# EAGLE design QRsch_v2.0 (EAGLE 7.2.0)
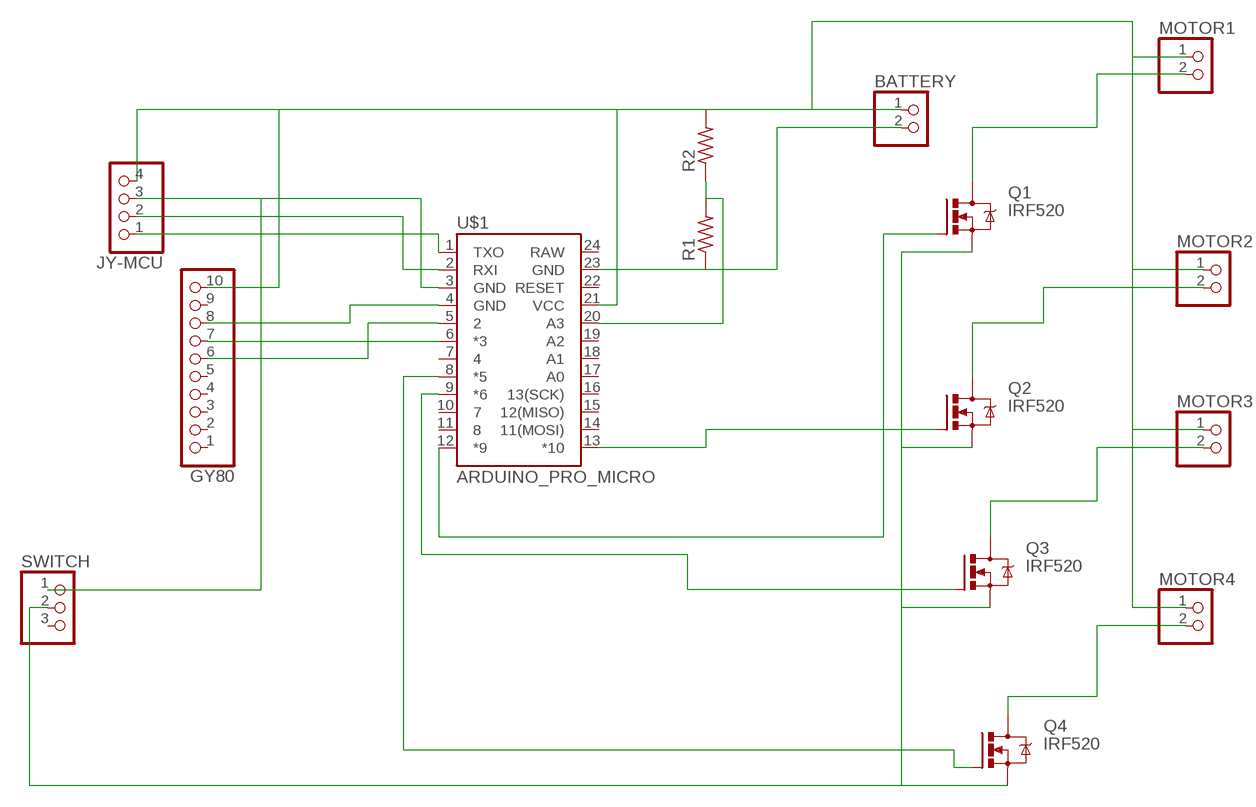
[diagram p0: schematic, sheet 1]

## Parts
BATTERY  PINHD-1X2/90  [1X02/90]
GY80  PINHD-1X10  [1X10]
JY-MCU  PINHD-1X4  [1X04]
MOTOR1  PINHD-1X2/90  [1X02/90]
MOTOR2  PINHD-1X2/90  [1X02/90]
MOTOR3  PINHD-1X2/90  [1X02/90]
MOTOR4  PINHD-1X2/90  [1X02/90]
Q1  IRF520  [TO220BV]
Q2  IRF520  [TO220BV]
Q3  IRF520  [TO220BV]
Q4  IRF520  [TO220BV]
R1  R-US_0207/7  [0207/7]
R2  R-US_0207/7  [0207/7]
SWITCH  PINHD-1X3  [1X03]
U$1  ARDUINO_PRO_MICRO  [ARDUINO_PRO_MICRO]

## Nets
GND: BATTERY.2 GY80.8 JY-MCU.3 R1.1 SWITCH.1 U$1.3(GND) U$1.4(GND) U$1.23(GND)
N$1: R1.2 R2.1 U$1.20(A3)
N$2: Q4.G U$1.8(*5)
N$3: Q3.G U$1.9(*6)
N$4: Q1.G U$1.12(*9)
N$5: MOTOR1.2 Q1.D
N$6: JY-MCU.2 U$1.2(RXI)
N$7: JY-MCU.1 U$1.1(TXO)
N$8: GY80.7 U$1.6(*3)
N$9: GY80.6 U$1.5
N$11: MOTOR2.2 Q2.D
N$12: MOTOR3.2 Q3.D
N$13: MOTOR4.2 Q4.D
N$15: Q1.S Q2.S Q3.S Q4.S SWITCH.2
N$27: Q2.G U$1.13(*10)
RAW: BATTERY.1 GY80.10 JY-MCU.4 MOTOR1.1 MOTOR2.1 MOTOR3.1 MOTOR4.1 R2.2 U$1.21(VCC)
Unconnected: GY80.1 GY80.2 GY80.3 GY80.4 GY80.5 GY80.9 SWITCH.3 U$1.7 U$1.10 U$1.11 U$1.14(11(MOSI)) U$1.15(12(MISO)) U$1.16(13(SCK)) U$1.17(A0) U$1.18(A1) U$1.19(A2) U$1.22(RESET) U$1.24(RAW)

## Library data of the parts
BATTERY MOTOR1-MOTOR4 = pinhead:PINHD-1X2: PIN HEADER
GY80 = pinhead:PINHD-1X10: PIN HEADER
JY-MCU = pinhead:PINHD-1X4: PIN HEADER
Q1-Q4 = transistor-power:IRF520: HEXFET Power MOSFET
R1 R2 = resistor:R-US_: RESISTOR, American symbol
SWITCH = pinhead:PINHD-1X3: PIN HEADER
U$1 = SparkFun-Boards:ARDUINO_PRO_MICRO

## Board
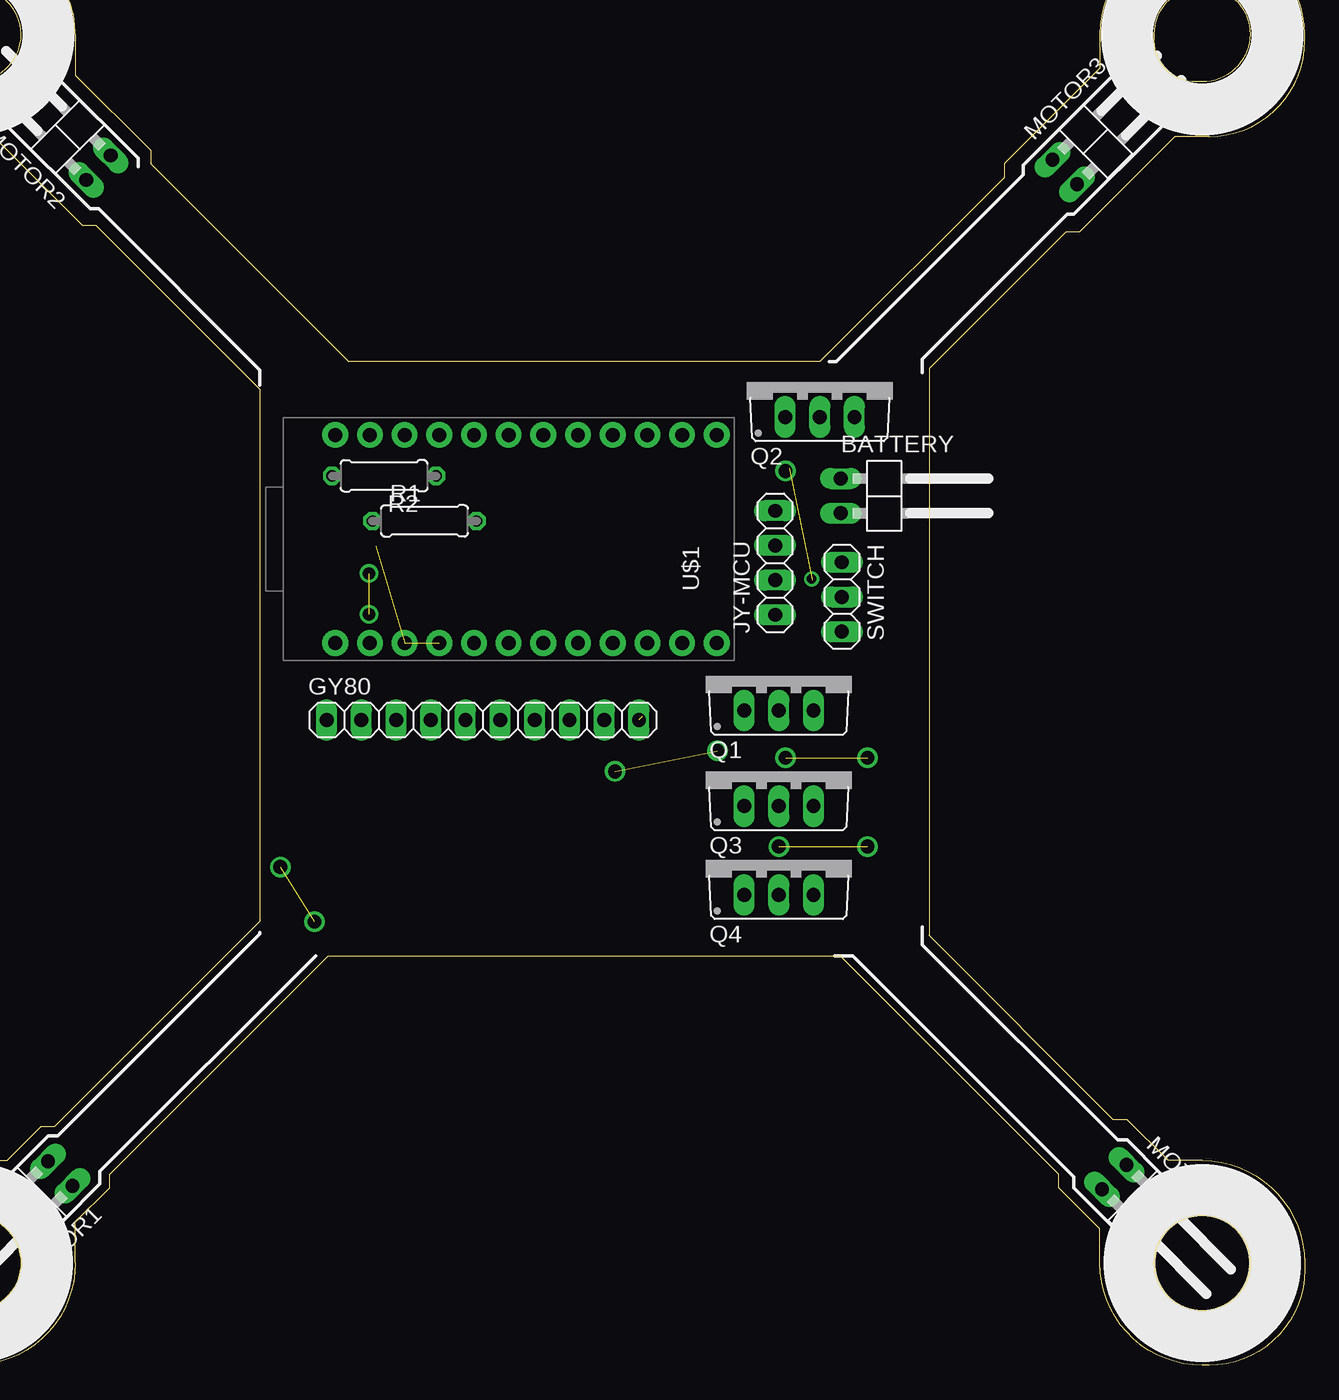
[diagram p1: board, top side]
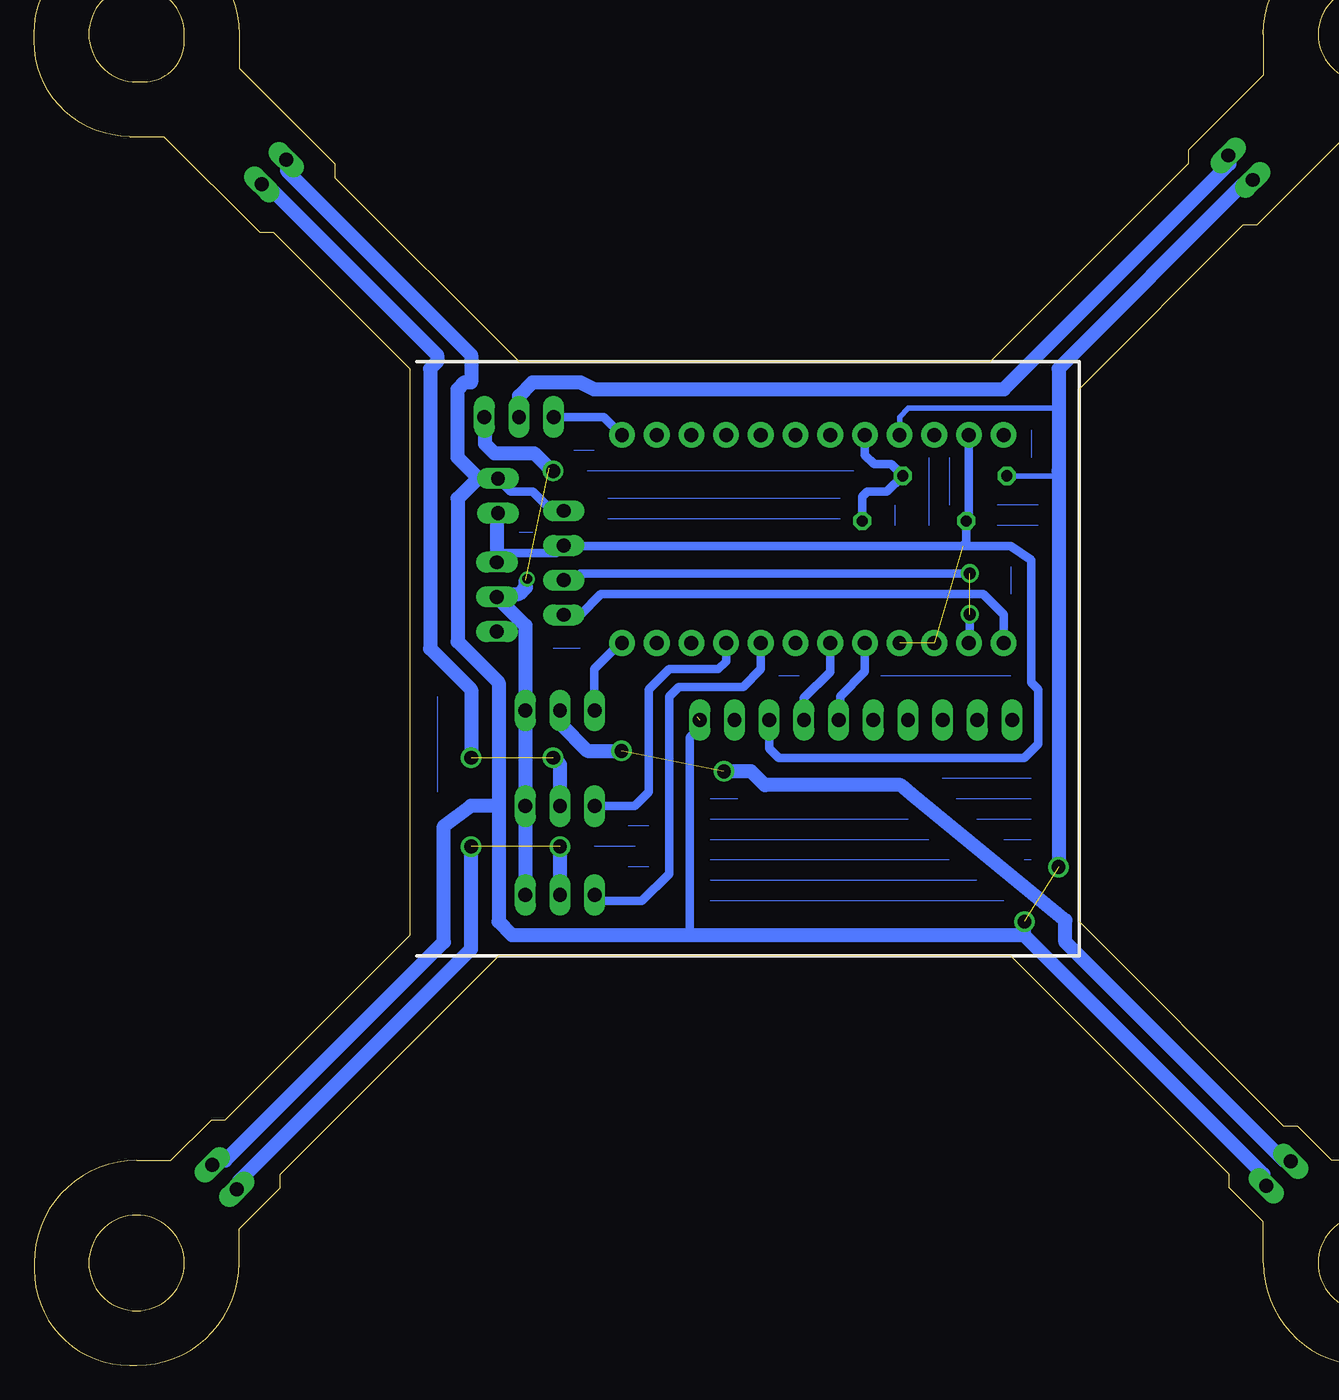
[diagram p2: board, bottom side, seen from below]

Size 7.5 x 97.5 mm. Coordinates in mm from the lower left corner, seen from the top.
Outline: 0.5,0 0,0
Outline: 7.5,97 7.5,97.5
Copper layers (1*16): Top 0.035mm / dielectric 1.5mm / Bottom 0.035mm
Design rules "default": minimum track width 10mil, minimum drill 24mil, track to track 8mil, track to pad 8mil, pad to pad 8mil, via to via 8mil, smd to smd 8mil, copper to edge 40mil, drill to drill 8mil, minimum pad ring 10mil, minimum via ring 8mil, stop-mask expansion 4mil, vias tented up to drill 0mil, thermal gap 10mil
Milling: 67 lines

### Footprints (pad centres in the part's own frame; a part is rotated, then mirrored left to right if it is on the bottom)
1X02/90 = drill 1.016 long: 1 -1.27,-3.81; 2 1.27,-3.81
1X10 = drill 1.016 long: 1 -11.43,0; 2 -8.89,0; 3 -6.35,0; 4 -3.81,0; 5 -1.27,0; 6 1.27,0; 7 3.81,0; 8 6.35,0; 9 8.89,0; 10 11.43,0
1X04 = drill 1.016 long: 1 -3.81,0; 2 -1.27,0; 3 1.27,0; 4 3.81,0
TO220BV = drill 1.016 long: D 0,-2.54; G -2.54,-2.54; S 2.54,-2.54
0207/7 = drill 0.813 octagon: 1 -3.81,0; 2 3.81,0
1X03 = drill 1.016 long: 1 -2.54,0; 2 0,0; 3 2.54,0
ARDUINO_PRO_MICRO = drill 1.016 pad 1.88: 1 -7.62,12.7; 2 -7.62,10.16; 3 -7.62,7.62; 4 -7.62,5.08; 5 -7.62,2.54; 6 -7.62,0; 7 -7.62,-2.54; 8 -7.62,-5.08; 9 -7.62,-7.62; 10 -7.62,-10.16; 11 -7.62,-12.7; 12 -7.62,-15.24; 13 7.62,-15.24; 14 7.62,-12.7; 15 7.62,-10.16; 16 7.62,-7.62; 17 7.62,-5.08; 18 7.62,-2.54; 19 7.62,0; 20 7.62,2.54; 21 7.62,5.08; 22 7.62,7.62; 23 7.62,10.16; 24 7.62,12.7

### Placement (x,y rotation side)
BATTERY  -22.65,63.68 270 top  (outside the outline)
GY80  -52.67,47.27 0 top  (outside the outline)
JY-MCU  -31.27,58.78 90 top  (outside the outline)
MOTOR1  -86.3,11.35 135 top  (outside the outline)
MOTOR2  -83.51,90.41 45 top  (outside the outline)
MOTOR3  -7.37,90.09 315 top  (outside the outline)
MOTOR4  -3.75,11.09 225 top  (outside the outline)
Q1  -31,50.5 0 top  (outside the outline)
Q2  -28,72 0 top  (outside the outline)
Q3  -31,43.5 0 top  (outside the outline)
Q4  -31,37 0 top  (outside the outline)
R1  -56.94,61.85 0 top  (outside the outline)
R2  -59.9,65.15 180 top  (outside the outline)
SWITCH  -26.38,56.28 270 top  (outside the outline)
U$1  -50.78,60.52 90 top  (outside the outline)

### Tracks (layer width: path | path; a pad name or v marks a point on that pad's centre or on a via)
GND  (2 unrouted)
  Bottom 0.61: U$1.23 -60.94,62.04 R1.1 -60.75,60.25 -60.5,60 | -60.5,60 -64,60 -65.5,59 -65.5,50 -66,49.5 -66,45.5 -65,44.5 -47,44.5 -46.32,45.18 GY80.8 | -26.38,59.5 -30.72,59.5 JY-MCU.3 -31.32,60 -60.5,60
  Bottom 1.016: BATTERY.2 -26.38,62.33 -26.38,59.5 SWITCH.1
N$1
  Bottom 0.61: U$1.20 -53.32,66.68 -54,66 -55.24,66 R2.1 -54.94,64 -53.5,64 -53.13,63.63 R1.2
N$2
  Bottom 0.61: Q4.G -33.58,34 -37,34 -39,36 -39,49 -39.7,49.7 -44.4,49.7 -45.7,51 U$1.8
N$3
  Bottom 0.61: Q3.G -36.46,40.96 -37.5,42 -37.5,49.5 -39,51 -42.6,51 -43.16,51.56 U$1.9
N$4
  Bottom 0.61: Q1.G -33.5,48 -33.5,51 -35.4,52.9 U$1.12
N$5  (via drill 1)  (1 unrouted)
  Bottom 1.016: MOTOR1.2 -84.45,15 -84,15 -68,31 -68,32.6 -56.95,41.65 -55.95,42.5 -46,42.5 -45,43.5 v-43,43.5 | Q1.D -31,47 -33,45 v-35.5,45
N$6  (via drill 0.9)  (1 unrouted)
  Bottom 0.61: U$1.2 -61,52.9 v-61,55 | JY-MCU.2 -32.5,57.51 -32.5,58 v-61,58
N$7
  Bottom 0.61: -31.3,55 JY-MCU.1 -32.47,54.97 -34,56.5 -62,56.5 -63.5,55 -63.5,54.04 -63.48,54.02 U$1.1
N$8
  Bottom 0.61: U$1.6 -50.78,50.78 -48.86,48.86 GY80.7
N$9
  Bottom 0.61: U$1.5 -53.32,50.82 -51.5,49 -51.5,47.37 GY80.6
N$11
  Bottom 1.016: Q2.D -28,71 -29,72 -32.5,72 -33.5,71.5 -63.5,71.5 -80,88 -80,88.53 MOTOR2.2
N$12  (via drill 1)  (1 unrouted)
  Bottom 1.016: MOTOR3.2 -9.66,86 -10,86 -22,74 -22,73.5 -21.5,73 -21.5,52.5 -24.5,49.5 -24.5,44.5 | Q3.D -31,44 v-30.5,44.5
N$13  (via drill 1)  (1 unrouted)
  Bottom 1.016: MOTOR4.2 -7.5,13.04 -7.5,13.5 -24.5,30.5 v-24.5,38 | -31,33.5 Q4.D v-31,38
N$14  (via drill 1)
  other vias: -30.5,65.5
N$15  (1 unrouted)
  Bottom 1.016: Q4.S Q3.S Q1.S -28.46,54.2 SWITCH.2 -26.6,56.5 -28,56.5 -28.5,57 -28.5,57.5 | Q2.S -25.5,69.42 -25.5,67.5 -26.2,66.8 -29.1,66.8 -30.2,65.7
N$18  (via drill 1)
  other vias: -24.5,44.5
N$19  (via drill 0.7 pad 1.02)
  other vias: -28.6,57.6
N$20
  Bottom 0: -56.5,40 -42,40
N$22
  Bottom 0: -58,38.5 -42,38.5
N$23
  Bottom 0: -59.5,37 -42,37
N$24
  Bottom 0: -61.5,35.5 -42,35.5
N$25
  Bottom 0: -63.5,34 -42,34
N$26
  Bottom 0: -44,41.5 -42,41.5
N$27
  Bottom 0.61: U$1.13 -34.22,69.46 Q2.G
N$28
  Bottom 0: -65.5,43 -59,43
N$29
  Bottom 0: -65.5,41.5 -60,41.5
N$30
  Bottom 0: -65.5,40 -61.5,40
N$31
  Bottom 0: -65.5,38.5 -63.5,38.5
N$32
  Bottom 0: -65.5,37 -65,37
N$33
  Bottom 0: -64,50.5 -54.5,50.5
N$34
  Bottom 0: -48.5,50.5 -47,50.5
N$35
  Bottom 0: -36.5,38 -33.5,38
N$36
  Bottom 0: -32.5,52.5 -30.5,52.5
N$37
  Bottom 0: -52.5,65.5 -33,65.5
N$38
  Bottom 0: -51.5,63.5 -34.5,63.5
N$39
  Bottom 0: -51.5,62 -34.5,62
N$40
  Bottom 0: -33.5,67 -32,67
N$41
  Bottom 0: -29,61 -28,61
N$42
  Bottom 0: -66,63 -63,63
N$43
  Bottom 0: -66,61.5 -63,61.5
N$44
  Bottom 0: -37.5,39.5 -36,39.5
N$45
  Bottom 0: -37.5,36.5 -36,36.5
N$46
  Bottom 0: -22,49 -22,42
N$47
  Bottom 0: -64,58.5 -64,56.5
N$48
  Bottom 0: -65.5,68.5 -65.5,66.5
N$49
  Bottom 0: -58,66.5 -58,61.5
N$51
  Bottom 0: -55.5,63 -55.5,61.5
N$52
  Bottom 0: -59.5,66.5 -59.5,63
RAW  (via drill 1)  (2 unrouted)
  Bottom 0.406: R2.2 -67.5,65.15 -67.5,65.5 | U$1.21 -55.86,69.46 -56.5,70.1 -67.5,70.1
  Bottom 0.61: -41,47.53 -41,46.5 -40.5,46 -40.5,31.5 | BATTERY.1 -27.41,64 -29,64 -30.41,62.59 JY-MCU.4
  Bottom 1.016: -26.5,41 -26.5,50 -23.5,53 -23.5,63.5 -25,65 | -26.5,41 -26.5,32.5 -27.5,31.5 -40.5,31.5 -65,31.5 | BATTERY.1 -26.41,65 -25,65 | -25,65 -23.5,66.5 -23.5,71.5 -24,72 -24.5,72 -24.5,74 -11,87.5 -11,88.26 MOTOR3.1 | -65,31.5 -82.5,14 -82.5,13.35 MOTOR1.1 | -26.5,41 -24.5,41 -22.5,39.5 -22.5,31 -6.5,15 -5.86,15 MOTOR4.1 | MOTOR2.1 -81.4,86.5 -81,86.5 -67.5,73 -67.5,70.1 -67.5,65.5 v-67.5,36.5 | -65,31.5 v-65,32.5